# EAGLE design LoNet 808 (EAGLE 7.5.0)
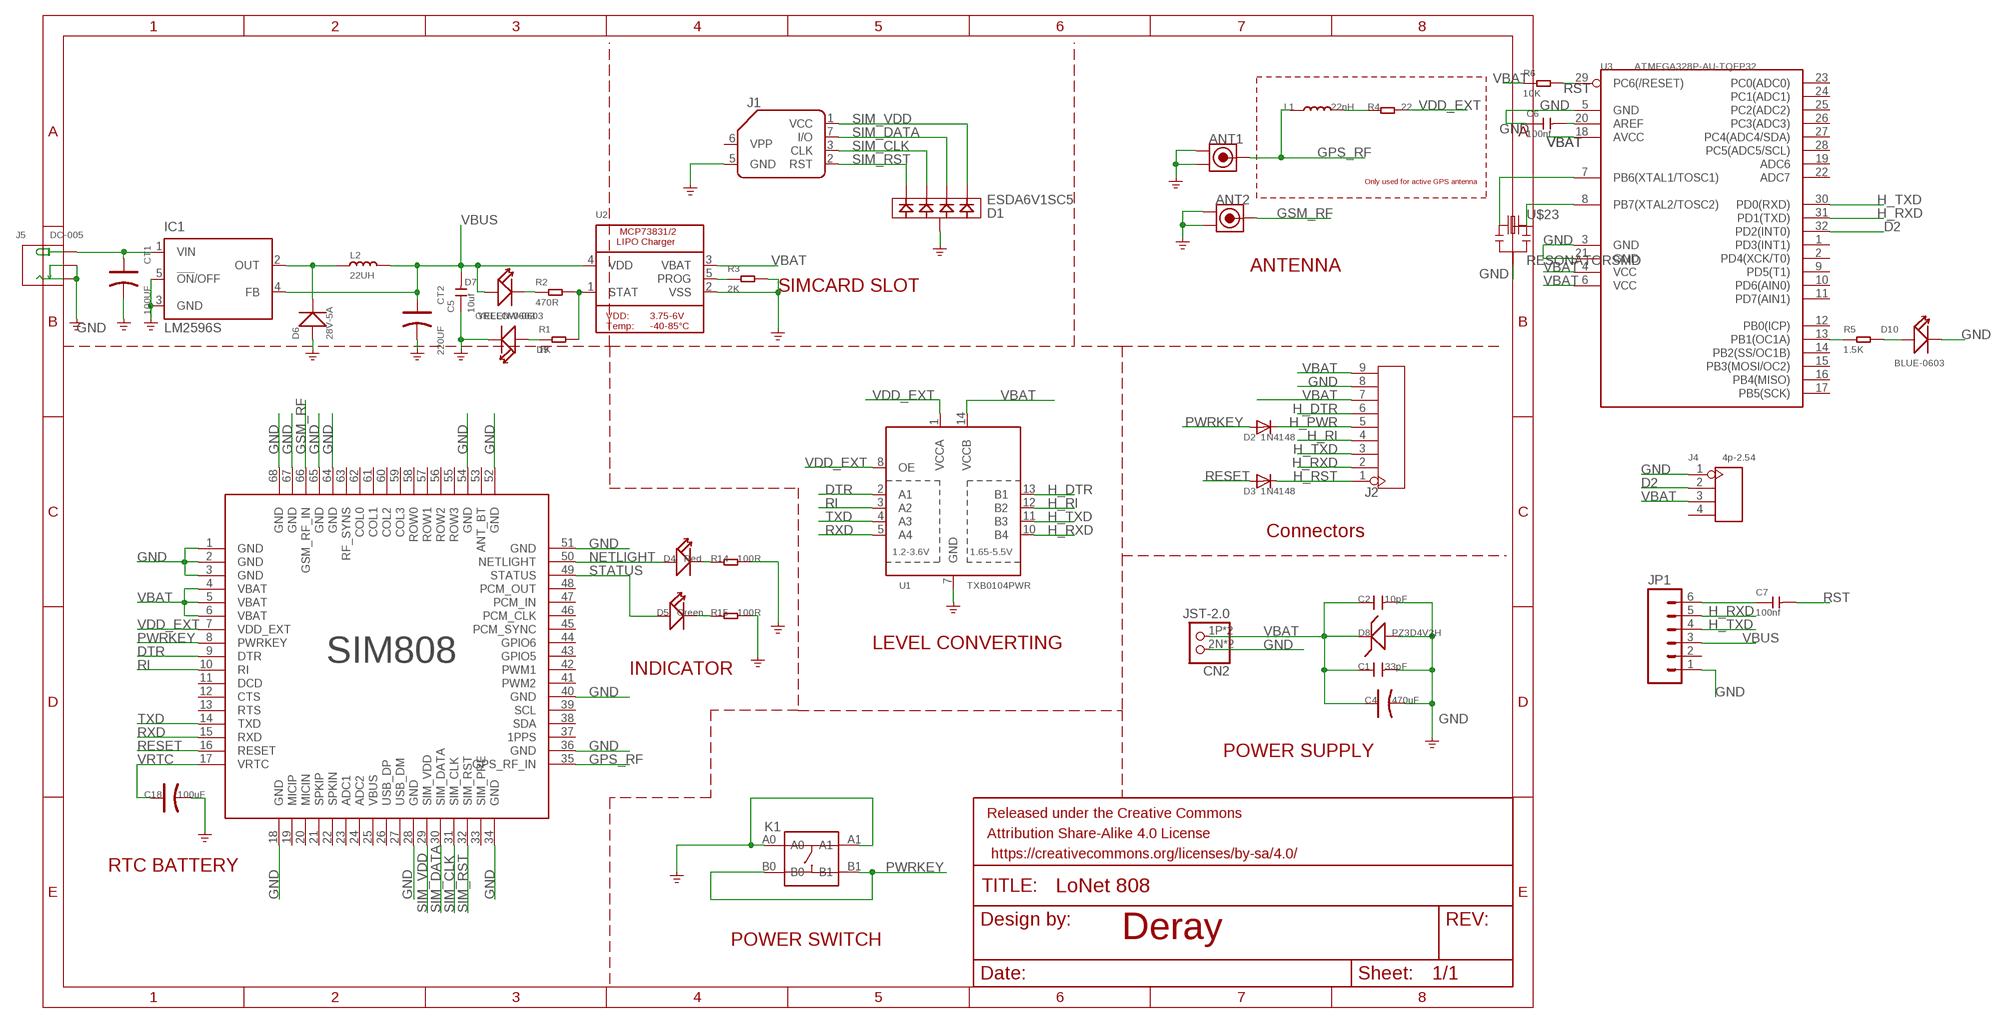
[diagram p0: schematic, sheet 1]

## Parts
ANT1  ANTENNA-U-FL'3PAD-TYPE'  [3P-U-FL]
ANT2  ANTENNA-U-FL'3PAD-TYPE'  [3P-U-FL]
C1  33pF  C-0603  [0603]
C2  10pF  C-0603  [0603]
C4  470uF  CAP-AVX-D  [AVX-D]
C5  10uf  CERAMIC-10UF-10V-10%-X5R(0603)  [C0603]
C6  100nf  CERAMIC-100NF-50V-10%-X7R(0603)  [C0603]
C7  100nf  CERAMIC-100NF-50V-10%-X7R(0603)  [C0603]
C18  100uF  CAP-AVX-A  [AVX-A]
CN2  JST-2.0  JST_2PIN  [JST-PH-2-SMT-RA2]
CT1  100UF  ALUMINUM-SMD-100UF-50V-20%(D6MM)  [ELECTRO-SMD-C-6MM]
CT2  220UF  ALUMINUM-SMD-220UF-16V(D6.3-H7.7MM)  [ELECTRO-SMD-C-6MM]
D1  ESDA6V1SC5  [SOT23-5L]
D2  1N4148  DIODESOD-323F  [SOD-323F]
D3  1N4148  DIODESOD-323F  [SOD-323F]
D4  Red  LED-0603  [0603]
D5  Green  LED-0603  [0603]
D6  28V-5A  SMD-DIODE-SCHOTTKY-28V-5A(DO-214AA)  [DO-214AA]
D7  YELLOW-0603  SMD-LED-CLEAR-YELLOW(0603)  [LED-0603]
D8  PZ3D4V2H  ZENER-DIODE  [SOD-323F]
D9  GREEN-0603  SMD-LED-CLEAR-GREEN(0603)  [LED-0603]
D10  BLUE-0603  SMD-LED-CLEAR-BLUE(0603)  [LED-0603]
IC1  LM2596S  [TO263-5]
J1  SIMHOLDERSIM  [SIMHOLDER]
J2  HEADER-9P-2.54  [9P-2.54]
J4  4p-2.54  DIP-BLACK-FEMALE-HEADER-VERT(4P-2.54)  [H4-2.54]
J5  DC-005  CONN-POWER-JACK-2.1MM(DC-005)  [DCJ3P-14.2X11.0X9.0MM]
JP1  M06SIP  [1X06]
K1  BUTTON-4P-3.3X3.3  [4P-SMD-3.4X3.4X1.3H]
L1  22nH  L'0402'  [L0402]
L2  22UH  SMD-INDUCTOR-22UH-20%(2P-2.0X1.2MM)  [SMD-2P-2.0X1.2X1.0MM]
R1  1K  SMD-RES-1K-1%-1/10W(0603)  [R0603]
R2  470R  SMD-RES-470R-5%-1/10W(0603)  [R0603]
R3  2K  SMD-RES-2K-1%-1/10W(0603)  [R0603]
R4  22  R-0402  [R0402]
R5  1.5K  SMD-RES-1.5K-1%-1/10W(0603)  [R0603]
R6  10K  SMD-RES-10K-1%-1/10W(0603)  [R0603]
R14  100R  R-0603  [0603]
R15  100R  R-0603  [0603]
U1  TXB0104PWR  [TSSOP14]
U2  MCP73831/2  [SOT23-5]
U3  ATMEGA328P-AU-TQFP32  MCU-ATMEGA328P-AU(TQFP32)  [TQFP32-0.8-7X7MM]
U$1  SIM80868P-SMD-24X24  [68P-SMD-24X24]
U$23  RESONATORSMD  [RESONATOR-SMD]

## Nets
D2: J4.2 U3.32(PD2(INT0))
DTR: U1.2(A1) U$1.9(DTR)
GND: ANT1.GND1 ANT1.GND2 ANT2.GND1 ANT2.GND2 C1.2 C2.2 C4.- C5.1 C6.1 C18.- CN2.2N CN2.4N CT1.- CT2.- D1.2 D6.+ D8.A D9.- D10.- IC1.3(GND) IC1.5(!ON!/OFF) J1.5(GND) J2.8 J4.1 J5.-1(-) J5.-2(CDN) JP1.1 K1.A0 K1.A1 R3.2 R14.2 R15.2 U1.7(GND) U2.2(VSS) U3.3(GND) U3.5(GND) U3.21(GND) U$1.1(GND) U$1.2(GND) U$1.3(GND) U$1.18(GND) U$1.28(GND) U$1.34(GND) U$1.36(GND) U$1.40(GND) U$1.51(GND) U$1.52(GND) U$1.54(GND) U$1.64(GND) U$1.65(GND) U$1.67(GND) U$1.68(GND) U$23.2
GPS_RF: ANT1.D L1.1 U$1.35(GPS_RF_IN)
GSM_RF: ANT2.D U$1.66(GSM_RF_IN)
H_DTR: J2.6 U1.13(B1)
H_PWR: D2.C J2.5
H_RI: J2.4 U1.12(B2)
H_RST: D3.C J2.1
H_RXD: J2.2 JP1.5 U1.10(B4) U3.31(PD1(TXD))
H_TXD: J2.3 JP1.4 U1.11(B3) U3.30(PD0(RXD))
N$1: CT1.+ IC1.1(VIN) J5.+
N$2: D6.- IC1.2(OUT) L2.1
N$3: R1.2 R2.2 U2.1(STAT)
N$5: R3.1 U2.5(PROG)
N$6: L1.2 R4.1
N$8: D7.- R2.1
N$9: D4.- R14.1
N$10: D5.- R15.1
N$11: C6.2 U3.20(AREF)
N$12: D9.+ R1.1
N$13: R5.1 U3.13(PB1(OC1A))
N$14: D10.+ R5.2
N$15: U3.7(PB6(XTAL1/TOSC1)) U$23.1
N$16: U3.8(PB7(XTAL2/TOSC2)) U$23.3
N$18: C7.1 JP1.6
NETLIGHT: D4.+ U$1.50(NETLIGHT)
PWRKEY: D2.A K1.B0 K1.B1 U$1.8(PWRKEY)
RESET: D3.A U$1.16(RESET)
RI: U1.3(A2) U$1.10(RI)
RST: C7.2 R6.2 U3.29(PC6(/RESET))
RXD: U1.5(A4) U$1.15(RXD)
SIM_CLK: D1.3 J1.3(CLK) U$1.31(SIM_CLK)
SIM_DATA: D1.5 J1.7(I/O) U$1.30(SIM_DATA)
SIM_RST: D1.1 J1.2(RST) U$1.32(SIM_RST)
SIM_VDD: D1.4 J1.1(VCC) U$1.29(SIM_VDD)
STATUS: D5.+ U$1.49(STATUS)
TXD: U1.4(A3) U$1.14(TXD)
VBAT: C1.1 C2.1 C4.+ CN2.1P CN2.3P D8.C J2.7 J2.9 J4.3 R6.1 U1.14(VCCB) U2.3(VBAT) U3.4(VCC) U3.6(VCC) U3.18(AVCC) U$1.4(VBAT) U$1.5(VBAT) U$1.6(VBAT)
VBUS: C5.2 CT2.+ D7.+ IC1.4(FB) JP1.3 L2.2 U2.4(VDD)
VDD_EXT: R4.2 U1.1(VCCA) U1.8(OE) U$1.7(VDD_EXT)
VRTC: C18.+ U$1.17(VRTC)
Unconnected: J1.6(VPP) J4.4 JP1.2 U3.1(PD3(INT1)) U3.2(PD4(XCK/T0)) U3.9(PD5(T1)) U3.10(PD6(AIN0)) U3.11(PD7(AIN1)) U3.12(PB0(ICP)) U3.14(PB2(SS/OC1B)) U3.15(PB3(MOSI/OC2)) U3.16(PB4(MISO)) U3.17(PB5(SCK)) U3.19(ADC6) U3.22(ADC7) U3.23(PC0(ADC0)) U3.24(PC1(ADC1)) U3.25(PC2(ADC2)) U3.26(PC3(ADC3)) U3.27(PC4(ADC4/SDA)) U3.28(PC5(ADC5/SCL)) U$1.11(DCD) U$1.12(CTS) U$1.13(RTS) U$1.19(MICIP) U$1.20(MICIN) U$1.21(SPKIP) U$1.22(SPKIN) U$1.23(ADC1) U$1.24(ADC2) U$1.25(VBUS) U$1.26(USB_DP) U$1.27(USB_DM) U$1.33(SIM_PRE) U$1.37(1PPS) U$1.38(SDA) U$1.39(SCL) U$1.41(PWM2) U$1.42(PWM1) U$1.43(GPIO5) U$1.44(GPIO6) U$1.45(PCM_SYNC) U$1.46(PCM_CLK) U$1.47(PCM_IN) U$1.48(PCM_OUT) U$1.53(ANT_BT) U$1.55(ROW3) U$1.56(ROW2) U$1.57(ROW1) U$1.58(ROW0) U$1.59(COL3) U$1.60(COL2) U$1.61(COL1) U$1.62(COL0) U$1.63(RF_SYNS)

## Notes on the sheet
- Only used for active GPS antenna
- ANTENNA
- SIMCARD SLOT
- Connectors
- LEVEL CONVERTING
- INDICATOR
- POWER SUPPLY
- RTC BATTERY
- Deray
- POWER SWITCH

## Library data of the parts
ANT1 ANT2 = Connector:ANTENNA-U-FL
C1 C2 = Common:C*
C4 = Common:CAP*
C5 = Seeed-OPL-Capacitor:CERAMIC-10UF-10V-10%-X5R(0603): 302010103; MPN: CC0603KRX5R6BB106
C6 C7 = Seeed-OPL-Capacitor:CERAMIC-100NF-50V-10%-X7R(0603): 302010138; MPN: CC0603KRX7R9BB104
C18 = Discrete:CAP*: Electrolytic Capacitors,Tantalum Capacitors and Super Capacitors
CN2 = adafruit:JST_2PIN: JST 2-Pin Connectors of various flavors SMT-RA (S2B-PH-SM4) 4UConnector #17311 SMT (B2B-PH-SM4) THM-RA (S2B-PH) THM (B2B-PH)
CT1 = Seeed-OPL-Capacitor:ALUMINUM-SMD-100UF-50V-20%(D6MM): 302030090; MPN: CS1H101M-CRE77
CT2 = Seeed-OPL-Capacitor:ALUMINUM-SMD-220UF-16V(D6.3-H7.7MM): 302030053; MPN: CS1E221M-CRE77
D1 = Semiconductors:ESDA6V1SC5: Quad Transil array for ESD protection STMicroelectronics http://www.st.com/internet/com/TECHNICAL_RESOURCES/TECHNICAL_LITERATURE/DATASHEET/CD00002055.pdf
D2 D3 = Semiconductors:DIODE: Diode SMADIODE - SMA Surface Mount Package 20V 1A Schottky Diode Digikey: 641-1014-6-ND DO-1N4148 - Through Hole Small Current Diode SOD-123 20V 1 A (.5mV Vf) Schottky Diode - Digikey: MBRX120TPMSCT-ND SOD-323 10V 570mA (.38mV Vf, 3ns) Schottky Diode - Digikey: ZLLS410CT-ND SOD-523 30V 30mA Schottky Diode (RB751S-40TE61) - Digikey: RB751S-40TE61CT-ND SOT23-R/W - SOT23 Package (R = Solder Paste/Reflow Ovens, W = Hand-Soldering) BAT54Film 40V 300mA - Digikey: 497-7162-1-ND
D4 D5 = LEDs:LED*
D6 = Seeed-OPL-Diode:SMD-DIODE-SCHOTTKY-28V-5A(DO-214AA): 304020021; MPN: SS54B
D7 = Seeed-OPL-Diode:SMD-LED-CLEAR-YELLOW(0603): 304090044; MPN: 19-217-Y5C-AM1N1VY-3T
D8 = Semiconductors:ZENER-DIODE
D9 = Seeed-OPL-Diode:SMD-LED-CLEAR-GREEN(0603): 304090043; MPN: 19-217-G7C-AN1P2-3T
D10 = Seeed-OPL-Diode:SMD-LED-CLEAR-BLUE(0603): 304090045; MPN: 19-217-BHC-ZL1M2RY-3T
IC1 = national-semiconductor:LM2596: SIMPLE SWITCHER® Power Converter 150 kHz 3A Step-Down Voltage Regulator Source: http://www.national.com/ds/LM/LM2596.pdf; MF: NATIONAL SEMICONDUCTOR; MPN: LM2596S-ADJ/NOPB; OC_FARNELL: 9494367; OC_NEWARK: 41K3842
J1 = SparkFun-Connectors:SIMHOLDER: SIM Socket Socket for SIM cellular cards. Schematic element and footprint production proven. Spark Fun Electronics SKU : PRT-00548; PROD_ID: CONN-08536
J2 = Connector:HEADER-9P
J4 = Seeed-OPL-Connector:DIP-BLACK-FEMALE-HEADER-VERT(4P-2.54): 320030017; MPN: F185-1104A1BSYA1
J5 = Seeed-OPL-Connector:CONN-POWER-JACK-2.1MM(DC-005): 320120003; MPN: DC-005
JP1 = SparkFun-Connectors:M06: Header 6 Standard 6-pin 0.1" header. Use with straight break away headers (SKU : PRT-00116), right angle break away headers (PRT-00553), swiss pins (PRT-00743), machine pins (PRT-00117), and female headers (PRT-00115). Molex polarized connector foot print use with SKU : PRT-08094 with associated crimp pins and housings. NOTES ON THE VARIANTS LOCK and LOCK_LONGPADS... This footprint was designed to help hold the alignment of a through-hole component (i.e. 6-pin header) while soldering it into place. You may notice that each hole has been shifted either up or down by 0.005 of an inch from it's more standard position (which is a perfectly straight line). This slight alteration caused the pins (the squares in the middle) to touch the edges of the holes. Because they are alternating, it causes a "brace" to hold the component in place. 0.005 has proven to be the perfect amount of "off-center" position when using our standard breakaway headers. Although looks a little odd when you look at the bare footprint, once you have a header in there, the alteration is very hard to notice. Also, if you push a header all the way into place, it is covered up entirely on the bottom side. This idea of altering the position of holes to aid alignment will be further integrated into the Sparkfun Library for other footprints. It can help hold any component with 3 or more connection pins.
K1 = Discrete:BUTTON-4P
L1 = Discrete:L*
L2 = Seeed-OPL-Inductor:SMD-INDUCTOR-22UH-20%(2P-2.0X1.2MM): 303010141; MPN: MPH201210S22RMT
R1 = Seeed-OPL-Resistor:SMD-RES-1K-1%-1/10W(0603): 301010298; MPN: RC0603FR-071KL
R2 = Seeed-OPL-Resistor:SMD-RES-470R-5%-1/10W(0603): 301010088; MPN: RC0603JR-07470RL
R3 = Seeed-OPL-Resistor:SMD-RES-2K-1%-1/10W(0603): 301010221; MPN: RC0603FR-072KL
R4 = Discrete:R*
R5 = Seeed-OPL-Resistor:SMD-RES-1.5K-1%-1/10W(0603): 301010189; MPN: RC0603FR-071K5L
R6 = Seeed-OPL-Resistor:SMD-RES-10K-1%-1/10W(0603): 301010299; MPN: RC0603FR-0710KL
R14 R15 = Common:R*
U1 = adafruit:TXB0104PWR: 4-Bit Bi-Directional Level Shifter 1.2V-3.6V (VCCA) to 1.65V-5.5V (VCCB) bi-directional level shifter with auto direction sensing. Max data rate - VCCA 1.8V: 20Mbps (50ns), VCCA 3.3V: 100Mbps (10ns) Digikey: 296-21929-1-ND
U2 = LBRmicrobuilder:MCP73831/2: MCP73831/2 LIPO Charger VDD: 3.75 - 6V Temp -40 - 85°C Programmable Charge Rate: 15-500mA NOTE: STAT is a tri-state logic output on the MCP73831 and an open-drain output on the MCP73832. SOT23-5 with 4.2V output and tri-state logic on STAT = MCP73831T-2ACI/OT
U3 = Seeed-OPL-ic:MCU-ATMEGA328P-AU(TQFP32): 310010049; MPN: ATMEGA328P-AU
U$1 = Etronlibrary:SIM808
U$23 = SparkFun:RESONATOR: Resonator Small SMD resonator. This is the itty bitty 10/20MHz resonators with built in caps. CSTCE10M0G55 and CSTCE20M0V53. Footprint has been reviewed closely but hasn't been tested yet.

## Board
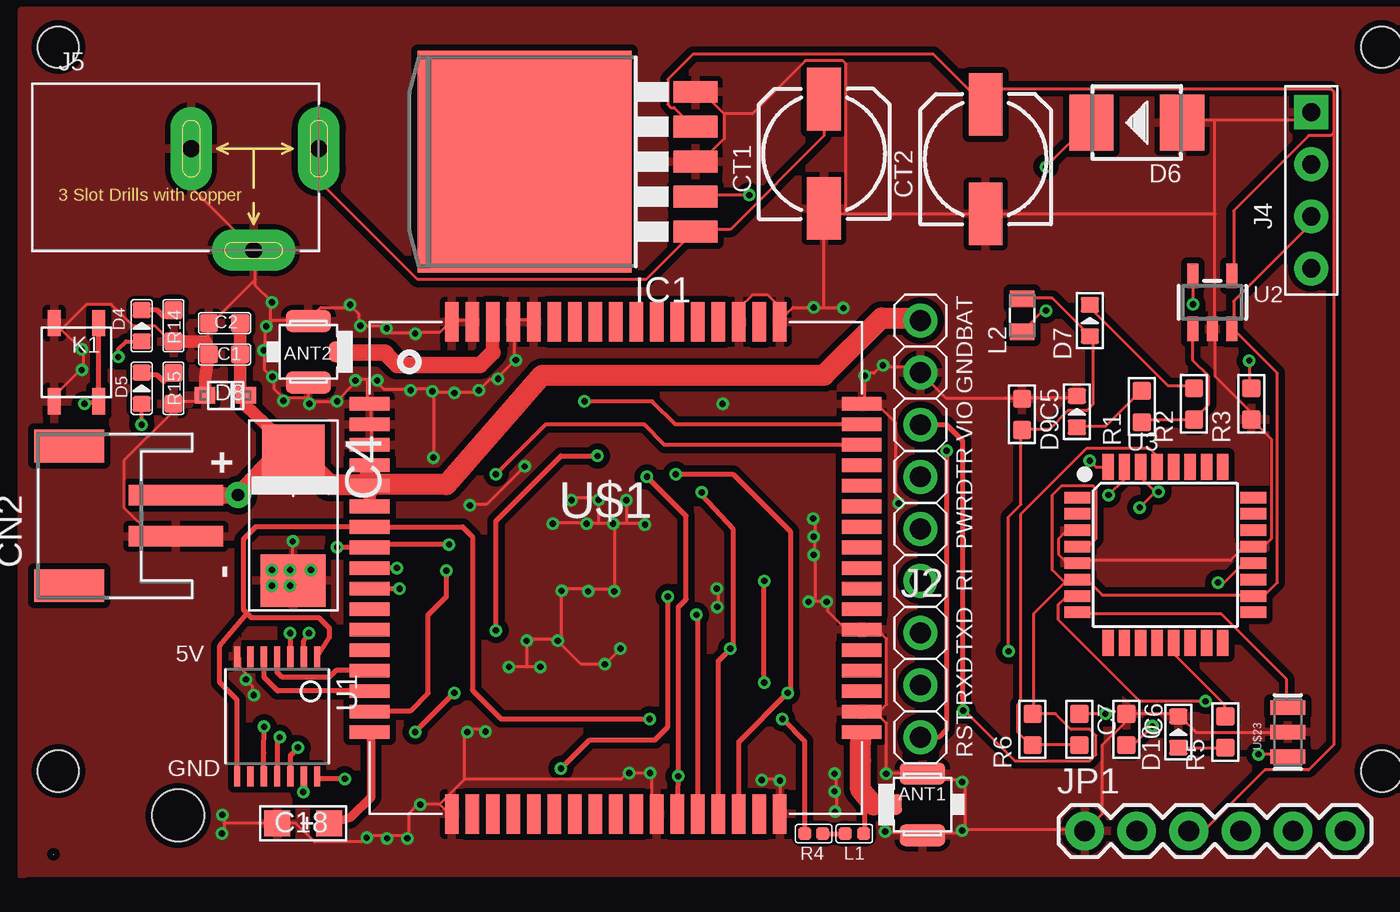
[diagram p1: board, top side]
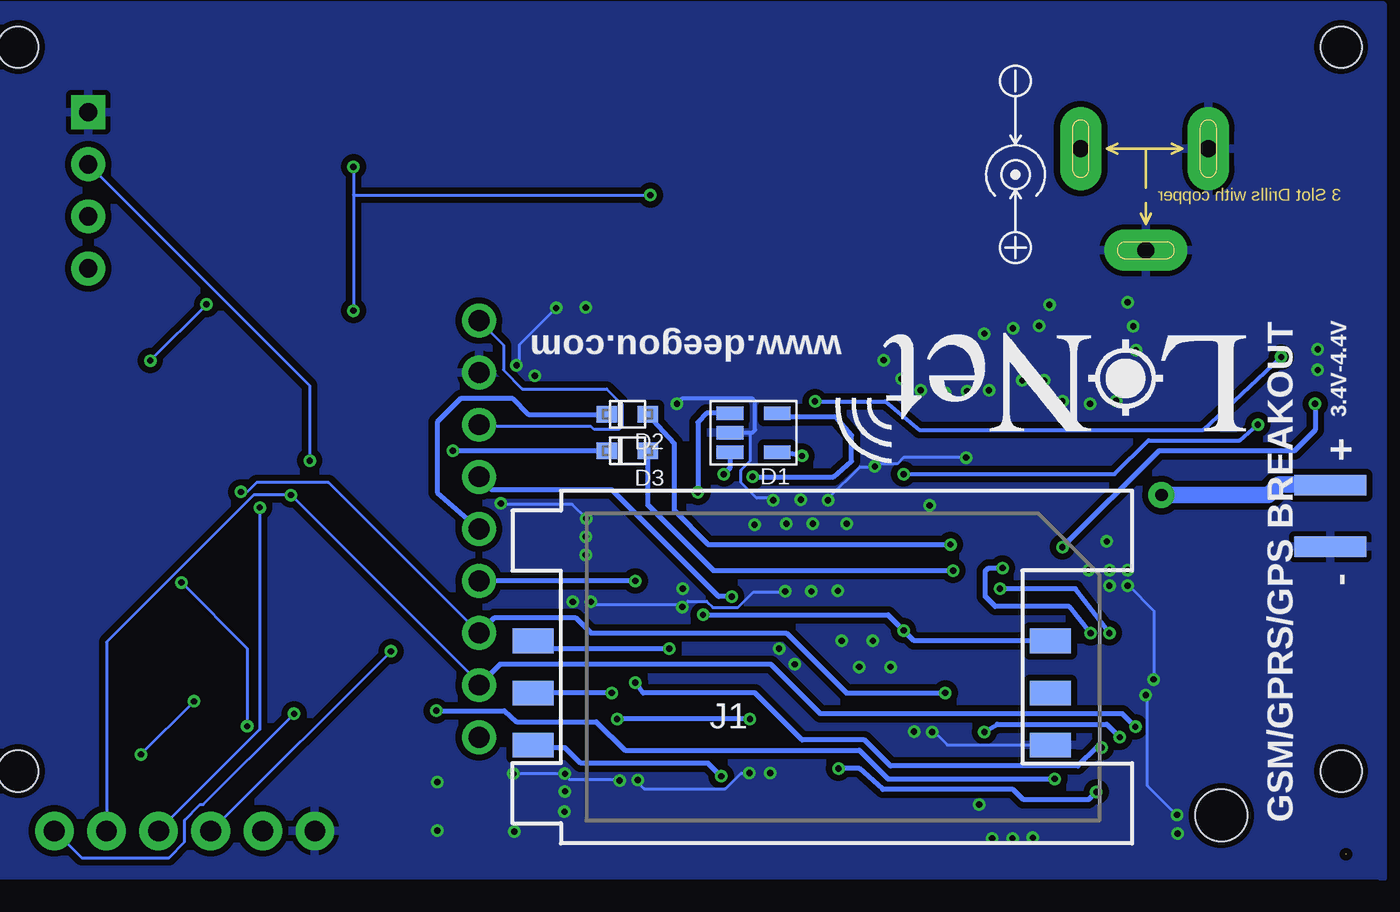
[diagram p2: board, bottom side, seen from below]

Size 0.02 x 0 mm. Coordinates in mm from the lower left corner, seen from the top.
Outline: 0,0 0.02,0
Copper layers (1*16): Top 0.035mm / dielectric 0.2mm / Bottom 0.035mm
Design rules "default *": minimum track width 6mil, minimum drill 12mil, track to track 6mil, track to pad 6mil, pad to pad 6mil, via to via 6mil, smd to smd 0mil, copper to edge 10mil, drill to drill 10mil, minimum pad ring 6mil, minimum via ring 6mil, stop-mask expansion 2mil, vias tented up to drill 25mil, thermal gap 10mil
Holes 2.54 mm at 6.1,1.91
Holes 2 mm at 64.77,4.06 0.25,4.06 0.25,39.37 64.77,39.37

### Footprints (pad centres in the part's own frame; a part is rotated, then mirrored left to right if it is on the bottom)
3P-U-FL = smd 1.05 x 1: D -1.524,0 | smd 2.2 x 1.05: GND1 0,1.5; GND2 0,-1.5
0603 = smd 0.889 x 0.889: 1 -0.762,0; 2 0.762,0
AVX-D = smd 2.54 x 3.048: + -3.175,0 | smd 2.54 x 3.175: - 3.175,0
C0603 = smd 0.889 x 0.889: 1 0,0.762; 2 0,-0.762
AVX-A = smd 1.27 x 1.27: + -1.27,0; - 1.27,0
JST-PH-2-SMT-RA2 = smd 1 x 4.6: 1P 1,-3.7; 2N -1,-3.7 | smd 1 x 3.5 bottom: 3P 1.5,1.5; 4N -1.5,1.5 | smd 1.6 x 3.4: NC1 -3.4,1.5; NC2 3.4,1.5
ELECTRO-SMD-C-6MM = smd 3.048 x 1.651: + 2.667,0; - -2.667,0
SOT23-5L = smd 0.65 x 1.3: 1 0,1.15; 2 0.95,1.15; 3 1.9,1.15; 4 1.9,-1.15; 5 0,-1.15
SOD-323F = smd 1 x 0.8: A -1,0; C 1,0
0603' = smd 0.762 x 0.889: + -0.762,0; - 0.762,0
DO-214AA = smd 2.159 x 2.743: + -2.21,0; - 2.21,0
LED-0603 = smd 0.762 x 0.889: + -0.762,0; - 0.762,0
TO263-5 = smd 1.067 x 2.159: 1 -3.404,-5.791; 2 -1.702,-5.791; 3 0,-5.791; 4 1.702,-5.791; 5 3.404,-5.791 | smd 10.8 x 10.41: 6 0,2.54
SIMHOLDER = smd 2 x 1.2: 1 -12.61,-3.81; 2 -12.61,-1.27; 3 -12.61,1.27; 5 12.61,-3.81; 6 12.61,-1.27; 7 12.61,1.27
9P-2.54 = drill 1.016 pad 1.651: 1 0,10.16; 2 0,7.62; 3 0,5.08; 4 0,2.54; 5 0,0; 6 0,-2.54; 7 0,-5.08; 8 0,-7.62; 9 0,-10.16
H4-2.54 = drill 0.889 pad 1.651 square: 1 0,3.81 | drill 0.889 pad 1.651: 2 0,1.27; 3 0,-1.27; 4 0,-3.81
DCJ3P-14.2X11.0X9.0MM = drill 0.813 pad 2.032 long: + 3.175,0; -1 -3.048,0; -2 0,-4.953
1X06 = drill 1.016 pad 1.88: 1 0,0; 2 2.54,0; 3 5.08,0; 4 7.62,0; 5 10.16,0; 6 12.7,0
4P-SMD-3.4X3.4X1.3H = smd 1.27 x 0.635: A0 -1.905,1.079; A1 1.905,1.079; B0 -1.905,-1.079; B1 1.905,-1.079
L0402 = smd 0.635 x 0.635: 1 -0.445,0; 2 0.445,0
SMD-2P-2.0X1.2X1.0MM = smd 0.8 x 1.2: 1 -0.8,0; 2 0.8,0
R0603 = smd 0.889 x 0.889: 1 0,0.762; 2 0,-0.762
R0402 = smd 0.635 x 0.635: 1 -0.445,0; 2 0.445,0
TSSOP14 = smd 0.305 x 0.991: 1 -1.95,-2.918; 2 -1.3,-2.918; 3 -0.65,-2.918; 4 0,-2.918; 5 0.65,-2.918; 6 1.3,-2.918; 7 1.95,-2.918; 8 1.95,2.918; 9 1.3,2.918; 10 0.65,2.918; 11 0,2.918; 12 -0.65,2.918; 13 -1.3,2.918; 14 -1.95,2.918
SOT23-5 = smd 0.55 x 1.2: 1 -0.95,-1.3; 2 0,-1.3; 3 0.95,-1.3; 4 0.95,1.3; 5 -0.95,1.3
TQFP32-0.8-7X7MM = smd 1.27 x 0.559: 1 -4.293,2.8; 2 -4.293,2; 3 -4.293,1.2; 4 -4.293,0.4; 5 -4.293,-0.4; 6 -4.293,-1.2; 7 -4.293,-2; 8 -4.293,-2.8; 17 4.293,-2.8; 18 4.293,-2; 19 4.293,-1.2; 20 4.293,-0.4; 21 4.293,0.4; 22 4.293,1.2; 23 4.293,2; 24 4.293,2.8 | smd 0.559 x 1.27: 9 -2.8,-4.293; 10 -2,-4.293; 11 -1.2,-4.293; 12 -0.4,-4.293; 13 0.4,-4.293; 14 1.2,-4.293; 15 2,-4.293; 16 2.8,-4.293; 25 2.8,4.293; 26 2,4.293; 27 1.2,4.293; 28 0.4,4.293; 29 -0.4,4.293; 30 -1.2,4.293; 31 -2,4.293; 32 -2.8,4.293
68P-SMD-24X24 = smd 1.93 x 0.66: 1 -12,8; 2 -12,7; 3 -12,6; 4 -12,5; 5 -12,4; 6 -12,3; 7 -12,2; 8 -12,1; 9 -12,0; 10 -12,-1; 11 -12,-2; 12 -12,-3; 13 -12,-4; 14 -12,-5; 15 -12,-6; 16 -12,-7; 17 -12,-8; 35 12,-8; 36 12,-7; 37 12,-6; 38 12,-5; 39 12,-4; 40 12,-3; 41 12,-2; 42 12,-1; 43 12,0; 44 12,1; 45 12,2; 46 12,3; 47 12,4; 48 12,5; 49 12,6; 50 12,7; 51 12,8 | smd 0.66 x 1.93: 18 -8,-12; 19 -7,-12; 20 -6,-12; 21 -5,-12; 22 -4,-12; 23 -3,-12; 24 -2,-12; 25 -1,-12; 26 0,-12; 27 1,-12; 28 2,-12; 29 3,-12; 30 4,-12; 31 5,-12; 32 6,-12; 33 7,-12; 34 8,-12; 52 8,12; 53 7,12; 54 6,12; 55 5,12; 56 4,12; 57 3,12; 58 2,12; 59 1,12; 60 0,12; 61 -1,12; 62 -2,12; 63 -3,12; 64 -4,12; 65 -5,12; 66 -6,12; 67 -7,12; 68 -8,12
RESONATOR-SMD = smd 0.7 x 1.7: 1 -1.2,0; 2 0,0; 3 1.2,0

### Placement (x,y rotation side)
ANT1  42.39,2.44 0 top  (outside the outline)
ANT2  12.45,24.51 180 top  (outside the outline)
C1  8.36,24.38 180 top  (outside the outline)
C2  8.36,25.91 180 top  (outside the outline)
C4  11.71,16.53 270 top  (outside the outline)
C5  47.24,21.46 0 top  (outside the outline)
C6  52.32,6.1 0 top  (outside the outline)
C7  50.04,6.1 0 top  (outside the outline)
C18  12.19,1.52 180 top  (outside the outline)
CN2  2.29,16.51 90 top  (outside the outline)
CT1  37.59,34.16 90 top  (outside the outline)
CT2  45.47,33.91 90 top  (outside the outline)
D1  28.91,19.61 90 bottom  (outside the outline)
D2  35.05,21.46 180 bottom  (outside the outline)
D3  35.05,19.68 180 bottom  (outside the outline)
D4  Red  [0603']  4.32,25.78 90 top  (outside the outline)
D5  Green  [0603']  4.32,22.73 90 top  (outside the outline)
D6  52.83,35.69 180 top  (outside the outline)
D7  50.55,26.04 90 top  (outside the outline)
D8  8.41,22.38 0 top  (outside the outline)
D9  49.91,21.59 90 top  (outside the outline)
D10  54.86,5.97 90 top  (outside the outline)
IC1  25.53,33.78 90 top  (outside the outline)
J1  27.05,9.14 0 bottom  (outside the outline)
J2  42.29,15.88 180 top  (outside the outline)
J4  61.34,32.38 0 top  (outside the outline)
J5  9.78,34.42 0 top  (outside the outline)
JP1  50.29,1.14 0 top  (outside the outline)
K1  1.14,24 90 top  (outside the outline)
L1  39.07,1.02 180 top  (outside the outline)
L2  47.24,26.29 90 top  (outside the outline)
R1  53.09,21.84 0 top  (outside the outline)
R2  55.63,21.97 0 top  (outside the outline)
R3  58.42,21.97 0 top  (outside the outline)
R4  37.08,1.02 180 top  (outside the outline)
R5  57.15,5.97 0 top  (outside the outline)
R6  47.75,6.1 0 top  (outside the outline)
R14  5.87,25.78 270 top  (outside the outline)
R15  5.87,22.73 270 top  (outside the outline)
U1  10.92,6.73 180 top  (outside the outline)
U2  56.51,26.92 0 top  (outside the outline)
U3  54.23,14.61 0 top  (outside the outline)
U$1  27.43,13.97 0 top  (outside the outline)
U$23  60.2,5.97 90 top  (outside the outline)

### Tracks (layer width: path | path; a pad name or v marks a point on that pad's centre or on a via)
D2  (via drill 0.3)
  Top 0.152: U3.32 50.85,18.9 v50.55,19.2
  Bottom 0.152: v50.55,19.2 50.55,22.86 J4.2
DTR  (via drill 0.3)
  Top 0.254: 15.11,13.97 U$1.9 v16.76,13.97 | U1.2 12.22,10.41 v12.47,10.79
  Bottom 0.254: v12.47,10.79 13.51,12.09 17.12,12.09 17.6,12.57 17.6,13.82 17.45,13.97 v16.76,13.97
GND  (via drill 0.3)
  Top 0.152: v27.66,10.03 v26.9,9.27 26.77,9.3 25.71,9.3 24.64,10.36 v24.61,10.41 | v23.75,9.14 23.11,9.14 | 23.11,9.14 v22.23,9.14 | 23.11,9.14 23.11,10.36 v23.09,10.41 23.11,10.52 24.49,10.52 v24.61,10.41 | v24.61,10.41 24.64,10.52 24.79,10.67 v24.79,12.85 24.79,12.95 26.01,12.95 v26.09,12.83 26.16,12.95 27.23,12.95 v27.36,12.83 27.38,12.95 27.38,16 v27.3,16.13 | v22.99,18.92 21.13,17.07 20.37,17.07 v20.32,17.02 | v25.27,17.27 25.4,17.37 26.47,17.37 v26.59,17.3 26.62,17.22 26.62,16.15 | 26.01,16.15 24.49,16.15 v24.36,16.13 | 26.01,16.15 26.62,16.15 | 26.62,16.15 27.23,16.15 v27.3,16.13 | 26.01,16.15 v26.01,16.13 | 27.99,16.15 27.38,16.15 v27.3,16.13 | 27.99,16.15 28.75,16.15 v28.85,16.08 | 27.99,16.15 27.99,17.22 v27.94,17.27 | U$1.64 23.42,26.06 22.5,26.06 U$1.65 22.5,25.91 22.5,24.23 v22.55,24.11 22.5,24.08 21.74,23.32 v21.69,23.19 21.59,23.16 21.29,23.16 v20.75,22.63 20.68,22.55 19.61,22.55 v19.56,22.5 19.46,22.55 18.54,22.55 | 18.54,22.55 v18.54,19.36 | 18.54,22.55 v18.49,22.58 18.39,22.71 17.48,22.71 v17.42,22.63 17.32,22.71 16.1,22.71 15.8,23.01 v15.8,23.11 15.8,23.16 15.34,23.16 | 0.41,25.6 0.1,25.91 K1.A1 | 0.41,25.6 1.32,24.69 v1.4,24.64 1.47,24.54 1.47,23.62 v1.4,23.62 1.32,23.62 0.1,22.4 0.1,22.1 K1.A0 | D8.A 7.26,22.1 5.89,22.1 R15.2 5.74,21.95 5.74,21.49 3.45,19.2 3.45,16.92 4.83,15.54 5.89,15.54 CN2.2N | 7.37,25.02 7.57,25.15 7.57,25.91 C2.2 7.72,25.91 9.86,28.04 | 0.41,25.6 1.63,26.82 2.85,26.82 3.91,25.76 4.98,25.76 5.59,25.15 R14.2 | U$1.67 20.37,26.06 19.46,26.06 U$1.68 19.3,25.91 18.85,25.45 17.78,25.45 v17.65,25.4 17.63,25.45 16.41,25.45 16.26,25.6 v16.26,25.65 16.26,25.76 15.04,25.76 v14.99,25.78 14.88,25.91 14.88,26.36 14.58,26.67 v14.48,26.8 14.43,26.67 13.06,26.67 12.45,26.06
  Top 0.152: 15.34,23.16 14.73,23.16 v14.73,23.11 14.73,23.01 13.82,22.1 | 15.34,23.16 15.34,22.1 U$1.1 15.49,21.95 15.49,21.03 U$1.2 15.49,20.88 15.49,20.12 U$1.3 | 10.62,26.06 10.62,25.91 10.46,25.76 v10.39,25.76 10.31,25.76 10.31,24.69 v10.26,24.59 10.31,24.54 10.31,23.62 10.62,23.32 v10.69,23.29 10.77,23.16 10.77,22.71 11.23,22.25 | 10.62,26.06 10.62,26.82 v10.67,26.92 9.86,27.74 9.86,28.04 | ANT2.GND1 12.45,22.25 | 12.45,22.25 12.45,22.1 v12.5,21.97 | 13.82,22.1 12.6,22.1 v12.5,21.97 | 12.45,22.25 11.23,22.25 | 11.23,22.25 v11.23,22.12 | 12.45,22.25 v12.5,21.97 | 10.62,26.06 12.45,26.06 | 13.82,22.1 v13.84,22.1 | 12.45,26.06 ANT2.GND2 | 9.86,28.04 9.86,29.41 J5.-2 9.7,29.57 6.81,32.46 6.81,34.29 J5.-1 | 56.64,35.81 60.91,35.81 61.21,36.12 J4.1 | 56.64,35.81 55.12,35.81 D6.+ | 49.94,14.33 49.33,14.33 49.02,14.63 49.02,15.39 49.33,15.7 49.94,15.7 U3.3 | 49.94,14.33 57.4,14.33 58.01,14.94 58.47,14.94 U3.21 58.62,15.09 59.08,15.09 59.38,15.39 59.38,20.27 58.47,21.18 R3.2 58.32,21.34 58.32,21.64 56.64,23.32 56.64,25.6 U2.2 56.64,25.76 56.64,31.24 | 49.94,14.33 U3.5 | 56.64,31.24 56.64,35.81 | D9.- 49.78,22.25 47.35,22.25 C5.1 47.19,22.25 43.54,22.25 J2.8 42.01,23.77 40.49,23.77 v40.46,23.85 40.33,23.77 40.03,23.47 39.57,23.47 v39.57,23.34 39.57,22.1 U$1.51 39.57,21.95 40.18,21.95 41.1,21.03 41.1,17.22 v41.22,17.12 | 32.71,36.12 32.71,34.9 31.65,33.83 31.34,33.83 IC1.3 | 32.71,36.12 31.65,37.19 IC1.5 | 37.59,26.67 v37.08,26.67 36.07,26.67 35.76,26.36 | 37.59,26.67 38.51,26.67 v38.53,26.64 | 35.76,26.36 35.46,26.06 U$1.52 | 35.76,26.36 34.85,27.28 34.09,27.28 33.48,26.67 33.48,26.06 U$1.54
  Top 0.152: 37.59,26.67 37.59,31.24 | 37.59,31.24 CT1.- 37.59,31.39 | 37.59,31.24 38.66,31.24 | 38.66,31.24 CT2.- 56.64,31.24 | 32.71,36.12 34.09,36.12 36.68,38.71 38.51,38.71 38.66,38.56 38.66,31.24 | v9.78,7.77 9.7,7.77 9.7,8.23 v9.4,8.53 9.4,8.84 9.09,9.14 9.09,9.6 U1.7 | 10.77,13.87 10.77,13.11 v10.67,13.11 | 10.77,13.87 v10.67,13.87 | 10.77,13.87 C4.- | v11.56,13.11 11.68,13.11 11.68,13.26 C4.- | C4.- 11.23,13.56 11.53,13.87 v11.56,13.87 11.68,13.87 | 11.68,13.87 v12.57,13.87 | 11.68,13.87 v11.68,15.27 | 8.33,1.52 8.33,1.83 v8.26,1.93 | 8.33,1.52 8.33,1.07 v8.23,1.02 | 8.33,1.52 C18.- 11.84,1.52 12.75,0.61 15.04,0.61 15.19,0.76 v15.29,0.81 15.34,0.91 16.26,0.91 v16.28,0.79 16.41,0.91 17.17,0.91 v17.27,0.79 17.32,0.91 17.32,1.98 17.78,2.44 v17.91,2.44 18.85,2.44 | v21.08,5.99 20.98,6.1 20.22,6.1 v20.19,5.97 20.07,5.94 20.07,3.66 | 18.85,2.44 19.3,1.98 U$1.18 | 18.85,2.44 20.07,3.66 | v37.06,16.38 37.13,16.31 37.13,15.54 v37.08,15.49 37.13,15.39 37.13,14.63 v37.08,14.61 37.13,14.48 37.13,12.34 | v32.38,12.06 32.41,12.19 32.41,12.95 v32.36,12.95 | 37.13,12.34 37.59,12.34 v37.72,12.32 37.74,12.19 37.74,11.89 38.66,10.97 U$1.40 39.57,10.82 40.33,10.82 40.64,10.52 40.64,7.32 40.18,6.86 | 37.13,12.34 36.83,12.34 v36.83,12.32 | U$23.2 60.15,5.94 55.73,5.94 54.97,6.71 D10.- 54.81,6.86 C6.1 52.22,6.86 52.22,6.4 51.16,5.33 51.16,1.98 50.39,1.22 JP1.1 50.24,1.22 44.45,1.22 | U$1.28 29.36,1.98 29.21,2.13 29.21,3.96 v29.11,3.96 v28.09,3.96 27.99,3.96 27.69,3.66 20.07,3.66 | v34.54,3.63 34.54,3.66 35.31,3.66 v35.43,3.61 35.46,3.5 35.46,1.98 U$1.34 | v40.56,1.12 40.64,1.07 42.32,1.07 ANT1.GND2 42.77,0.76 43.08,1.07 44.3,1.07 v44.32,1.17 44.45,1.22
  Top 0.152: v38.12,2.08 38.2,2.13 38.2,3.05 v38.1,3.07 38.2,3.2 38.2,3.81 v38.1,3.94 | 40.64,3.96 42.32,3.96 ANT1.GND1 42.47,3.81 42.62,3.66 44.3,3.66 v44.32,3.53 44.45,3.5 44.45,1.22 | 40.18,6.86 39.57,6.86 U$1.36 40.18,6.86 | 40.18,6.86 40.64,6.4 40.64,3.96 | 40.64,3.96 v40.61,3.94
  Top 0.254: ANT1.GND2 42.77,0.74
  Top 0.61: D8.A 7.41,23.24 C1.2 arc-90 7.49,24.49 7.49,24.89 arc90 7.37,25.02 R14.2
  Bottom 0.152: v25.27,17.27 25.25,17.37 23.72,18.9 23.11,18.9 v22.99,18.92 22.96,19.05 21.89,19.05 21.59,19.36 v18.54,19.36 | 28.97,20.56 29.06,20.57 29.06,19.2 29.52,18.75 29.52,18.14 28.75,17.37 27.99,17.37 v27.94,17.27 | v38.53,26.64 40.33,24.84 40.33,23.93 v40.46,23.85 | v9.4,8.53 9.4,11.89 10.62,13.11 v10.67,13.11 | J1.5 19.46,5.33 20.07,5.94 v20.19,5.97 | v9.78,7.77 9.7,7.77 9.7,3.35 8.33,1.98 v8.26,1.93 | v37.06,16.38 37.74,17.07 41.1,17.07 v41.22,17.12 | v36.83,12.32 36.83,12.19 32.41,12.19 v32.38,12.06 32.11,12.34 31.19,12.34 30.89,12.04 29.67,12.04 28.91,12.8 27.38,12.8 v27.36,12.83 | v40.61,3.94 40.49,3.96 38.2,3.96 v38.1,3.94 38.05,3.81 37.9,3.66 35.46,3.66 v35.43,3.61 | v29.11,3.96 29.52,3.96 30.28,3.2 34.24,3.2 34.54,3.5 v34.54,3.63
  Bottom 0.203: D1.2 28.97,20.56 28.83,20.7 28.83,22.1 28.96,22.23 32.38,22.23 v32.64,21.97
  pour Top (isolate 0.305): -1.27,-0.89 66.67,-0.89 66.67,41.15 -1.52,41.15 -1.52,-1.02
  pour Bottom (isolate 0.305): -1.65,-1.02 66.8,-1.02 66.8,41.4 -1.78,41.4 -1.78,-1.14
GPS_RF
  Top 0.254: L1.1 39.57,1.02 39.57,2.92 39.37,4.57
  Top 0.61: U$1.35 39.36,5.73
  Top 1.016: ANT1.D 40,2.41 39.37,3.17 39.37,4.57 39.37,5.46 39.36,5.73
GSM_RF
  Top 0.66: U$1.66 21.43,24.48
  Top 0.813: 21.43,24.48 20.83,23.88 16.76,23.88 16.26,24.38 16.26,24.41 16.18,24.49 14.38,24.49 ANT2.D
H_DTR  (via drill 0.3)
  Top 0.254: U1.13 v12.19,3.05 | v24.77,4.19 26.16,5.59 29.34,5.59 29.97,6.22 v29.97,12.57
  Bottom 0.254: v12.19,3.05 12.57,2.67 15.75,2.67 16.26,3.17 22.61,3.17 23.75,4.19 v24.77,4.19 | J2.6 41.66,17.78 35.81,17.78 30.61,12.57 v29.97,12.57
H_PWR
  Bottom 0.254: J2.5 44.32,17.65 44.32,21.08 43.18,22.23 40.64,22.23 39.88,21.46 D2.C
H_RI  (via drill 0.3)
  Top 0.254: U1.12 11.57,4.84 v11.94,5.21 | v34.67,8.38 v34.67,13.34
  Bottom 0.254: v11.94,5.21 12.19,5.21 13.08,4.32 22.23,4.32 23.5,5.59 26.54,5.59 28.83,7.87 34.29,7.87 v34.67,8.38 | v34.67,13.34 J2.4
H_RST  (via drill 0.3)
  Top 0.254: v43.56,19.68 43.56,6.1 43.18,5.71 J2.1
  Bottom 0.254: D3.C v43.56,19.68
H_RXD  (via drill 0.3)
  Top 0.152: v51.46,17.53 52.22,18.29 U3.31
  Top 0.254: U1.10 10.27,4.94 v10.29,6.22
  Bottom 0.152: J2.2 42.32,8.38 v51.46,17.53 53.29,17.53 60.45,10.36 JP1.5
  Bottom 0.254: v10.29,6.22 10.92,6.86 25.65,6.86 28.07,9.27 41.27,9.27 J2.2
H_TXD  (via drill 0.3)
  Top 0.152: 53.75,17.68 53.14,18.29 53.14,18.9 U3.30 | 53.75,17.68 v52.98,16.92 | 53.75,17.68 v53.9,17.68
  Top 0.254: v19.56,7.87 v17.65,5.97 | v11.05,5.71 10.92,5.59 U1.11
  Bottom 0.152: v53.9,17.68 53.59,17.68 53.14,18.14 49.63,18.14 J2.3 | v52.98,16.92 52.98,6.1 57.86,1.22 JP1.4
  Bottom 0.254: J2.3 41.53,11.56 37.59,11.56 36.83,10.79 27.3,10.79 24.38,7.87 v19.56,7.87 | v17.65,5.97 17.02,6.35 11.68,6.35 v11.05,5.71
N$1
  Top 0.152: CT1.+ 37.59,35.05 33.02,30.48 31.34,30.48 IC1.1 31.19,30.33 28.91,28.04 17.78,28.04 13.06,32.77 13.06,34.29 J5.+
N$2  (via drill 0.3)
  Top 0.152: v48.41,26.52 48.26,26.52 47.35,25.6 L2.1 | v48.41,33.53 50.55,35.66 D6.- | v33.93,32.16 31.34,32.16 IC1.2
  Bottom 0.152: v48.41,33.53 48.41,32.16 | 48.41,32.16 v48.41,26.52 | 48.41,32.16 v33.93,32.16
N$3
  Top 0.152: R1.2 53.14,21.18 55.57,21.18 R2.2 55.73,21.34 56.34,21.95 56.34,23.32 55.57,24.08 55.57,25.6 U2.1
N$5  (via drill 0.3)
  Top 0.152: v58.32,24.08 58.32,22.86 R3.1 | v55.57,26.82 55.57,28.19 U2.5
  Bottom 0.152: v55.57,26.82 v58.32,24.08
N$6
  Top 0.254: R4.1 L1.2
N$8
  Top 0.152: R2.1 55.57,22.86 54.36,22.86 50.55,26.67 D7.-
N$9
  Top 0.254: R14.1 5.4,26.23 5.08,26.54 D4.-
N$10
  Top 0.254: R15.1 5.4,23.05 5.08,23.37 4.45,23.37 D5.-
N$11  (via drill 0.3)
  Top 0.152: C6.2 52.68,5.33 v53.59,6.25 | v56.79,13.26 57.1,13.26 58.01,14.17 58.47,14.17 U3.20
  Bottom 0.152: v53.59,6.25 53.59,10.06 v56.79,13.26
N$12
  Top 0.152: D9.+ 49.94,20.88 51.31,20.88 52.98,22.55 R1.1
N$13
  Top 0.152: R5.1 57.1,6.86 57.1,7.32 54.66,9.75 54.66,10.21 U3.13
N$14
  Top 0.152: D10.+ 54.97,5.18 57.1,5.18 R5.2
N$15  (via drill 0.3)
  Top 0.152: v56.18,7.47 52.98,7.47 49.02,11.43 49.02,12.19 49.33,12.5 49.94,12.5 U3.7 | v58.78,4.88 60.15,4.88 U$23.1
  Bottom 0.152: v58.78,4.88 v56.18,7.47
N$16
  Top 0.152: U3.8 49.94,11.73 56.95,11.73 60.15,8.53 60.15,7.32 U$23.3
N$18  (via drill 0.3)
  Top 0.152: v51.31,6.86 C7.1
  Bottom 0.152: v51.31,6.86 55.73,2.44 55.88,2.44 56.64,1.68 56.64,0.61 57.4,-0.15 61.67,-0.15 62.89,1.07 JP1.6
NETLIGHT  (via drill 0.3)
  Top 0.203: v3.18,24.26 3.18,24.64 3.56,25.02 D4.+ | U$1.50 30.34,20.97 29.21,22.1 v25.91,22.1
  Bottom 0.203: v25.91,22.1 22.48,22.1 20.83,20.7 6.99,20.7 v3.18,24.26
PWRKEY  (via drill 0.3 pad 0.61)
  Top 0.254: v19.3,15.11 15.57,15.11 U$1.8 15.42,14.99 v13.84,14.99 | K1.B1 K1.B0 v1.52,21.97
  Bottom 0.254: v19.3,15.11 31.11,15.11 32.77,16.76 32.77,20.05 D2.A | v1.52,21.97 1.52,20.7 2.54,19.68 9.14,19.68 v13.84,14.99
RESET  (via drill 0.3 pad 0.61)
  Top 0.254: U$1.16 15.45,6.99 17.4,6.99 18.29,7.87 18.29,11.68 19.18,12.57 v19.18,13.84
  Bottom 0.254: v19.18,13.84 30.86,13.84 34.05,17.03 D3.A
RI  (via drill 0.3)
  Top 0.254: U1.3 11.57,10.5 v11.56,10.79 | v16.89,12.95 15.45,12.95 U$1.10
  Bottom 0.254: v11.56,10.79 13.21,12.95 v16.89,12.95
RST
  Top 0.152: C7.2 R6.2 47.65,5.33 47.04,5.94 47.04,7.32 47.19,7.47 47.19,16.61 50.39,19.81 53.44,19.81 53.75,19.51 53.75,18.9 U3.29
RXD
  Top 0.254: U$1.15 10.95,7.97 10.29,8.64 10.29,9.63 U1.5
SIM_CLK  (via drill 0.3)
  Top 0.254: U$1.31 32.43,9.45 v33.02,10.03 33.15,10.16 33.15,15.88 31.62,17.53 v31.62,17.65
  Bottom 0.254: v33.02,10.03 39.28,10.03 J1.3 | D1.3 31.19,21.51 31.62,21.08 v31.62,17.65
SIM_DATA  (via drill 0.3, 0.3 pad 0.61)
  Top 0.254: v21.59,10.92 21.59,16.26 24.77,19.43 v26.54,19.43 | U$1.30 31.43,11.49 v31.37,11.68
  Bottom 0.254: J1.7 21.08,10.41 v21.59,10.92 22.35,11.68 v31.37,11.68 | v26.54,19.43 27.68,19.68 D1.5
SIM_RST  (via drill 0.3)
  Top 0.254: U$1.32 33.43,5.49 v35.81,7.87 35.94,8 35.94,15.75 33.15,18.54 v30.35,18.54
  Bottom 0.254: v35.81,7.87 J1.2 40.13,7.87 | D1.1 30.06,18.84 v30.35,18.54
SIM_VDD  (via drill 0.3)
  Top 0.254: U$1.29 v30.48,3.81 30.48,12.06 30.86,12.45 30.86,16.51 v28.96,18.41
  Bottom 0.254: J1.1 39.53,5.21 38.1,5.21 37.34,4.45 31.11,4.45 v30.48,3.81 | 27.94,21.33 D1.4 27.58,21.34 24.89,21.34 24.13,20.45 24.13,19.18 25.02,18.41 v28.96,18.41
STATUS  (via drill 0.3)
  Top 0.203: v4.32,20.95 D5.+ | U$1.49 29.81,19.97 28.83,20.95 24,20.95 v21.59,18.54
  Bottom 0.203: v4.32,20.95 5.21,20.19 9.65,20.19 11.3,18.54 v21.59,18.54
TXD
  Top 0.254: U$1.14 13.8,8.97 13.46,8.64 11.18,8.64 10.92,8.89 U1.4
VBAT  (via drill 0.3 pad 0.61, 0.6 pad 1.27)
  Top 0.152: J4.3 61.21,31.09 61.21,30.63 57.56,26.98 57.56,25.76 U2.3 57.56,25.6 59.69,23.47 59.69,13.26 59.08,12.65 58.62,12.65 U3.18 58.47,12.65 51.16,12.65 50.55,13.26 49.94,13.26 | 47.8,6.86 47.8,11.73 49.33,13.26 | 49.94,13.26 49.33,13.26 | 49.33,13.26 48.72,13.87 48.72,17.53 49.17,17.98 50.7,17.98 50.85,17.83 50.85,15.39 50.55,15.09 49.94,15.09 U3.4 | 49.33,13.26 U3.6 49.94,13.26 | 47.8,6.86 48.87,6.86 49.63,6.1 50.55,6.1 50.85,5.79 50.85,4.88 50.55,4.57 46.89,4.57 44.45,7.01 v44.37,7.01 | 47.8,6.86 R6.1
  Top 0.254: J2.7 43.56,20.95 44.32,20.19 44.32,7.75 v44.37,7.01 | v14.22,3.68 13,3.68 U1.14
  Top 0.61: U$1.4 U$1.5 | U$1.5 U$1.6 | 15.47,17.58 U$1.5 | C4.+ 9.41,21.87 D8.C arc-90 9.12,22.67 C1.1 C2.1
  Top 0.813: 15.5,18.03 U$1.5 | C4.+ 11.07,19.7 v9.02,17.53 8.87,17.51 CN2.1P
  Top 1.016: 15.44,18.47 U$1.5 15.37,18.03 13.46,18.03 11.79,19.7 C4.+ | 15.5,18.03 19.18,18.03 23.85,23.37 37.59,23.37 40.39,26.16 42.16,26.16 J2.9
  Bottom 0.152: J2.9 41.1,24.84 41.1,23.62 40.18,22.71 36.07,22.71 35.31,21.95 35.31,20.88 35.46,20.73 36.68,20.73 36.83,20.88 42.16,20.88 J2.7
  Bottom 0.254: v44.37,7.01 41.05,7.01 40.46,6.48 36.58,6.48 35.18,5.08 23.75,5.08 22.35,3.68 v14.22,3.68
  Bottom 0.813: v9.02,17.53 3.81,17.53 3.3,18.03 1.13,18.03 CN2.3P
VBUS  (via drill 0.3)
  Top 0.152: L2.2 47.35,27.13 48.72,27.13 50.55,25.3 D7.+ 50.55,25.15 50.7,24.99 50.7,21.95 50.39,21.64 49.48,21.64 48.56,20.73 47.35,20.73 C5.2 47.19,20.57 47.19,17.07 46.58,16.46 v46.58,9.91 | 62.43,35.2 62.28,35.05 61.21,35.05 57.56,31.39 57.56,28.35 U2.4 | 62.43,35.2 62.43,37.19 62.28,37.34 46.28,37.34 45.52,36.58 CT2.+ 45.36,36.58 42.93,39.01 31.19,39.01 29.97,37.8 29.97,36.58 30.12,36.42 30.28,36.42 31.19,35.51 IC1.4 | 62.43,35.2 62.43,5.33 61.21,4.12 59.08,4.12 56.18,1.22 55.42,1.22 JP1.3
  Bottom 0.152: v46.58,9.91 55.27,1.22 JP1.3
VDD_EXT  (via drill 0.3 pad 0.61)
  Top 0.254: v29.08,6.6 21.84,6.6 20.45,8 20.45,15.49 19.97,15.97 U$1.7 9.87,15.97 9.27,15.37 9.27,11.94 9.46,11.75 | v35.56,6.6 36.64,5.52 R4.2 | 9.46,11.75 9.65,11.56 12.95,11.56 13.46,11.05 13.46,10.58 U1.1 | U1.8 8.97,7.54 8.13,8.38 8.13,10.16 9.46,11.75
  Bottom 0.254: v29.08,6.6 v35.56,6.6
VRTC
  Top 0.406: C18.+ 14.48,1.78 15.49,2.79 15.49,5.91 U$1.17

### Text on the board
tPlace: BAT | GND | VIO | DTR | PWR | RI | TXD | 5V | RXD | RST | GND
bPlace: 3.4V-4.4V | www.deegou.com | + | - | GSM/GPRS/GPS BREAKOUT